# EAGLE design displayadapter (EAGLE 7.2.0)
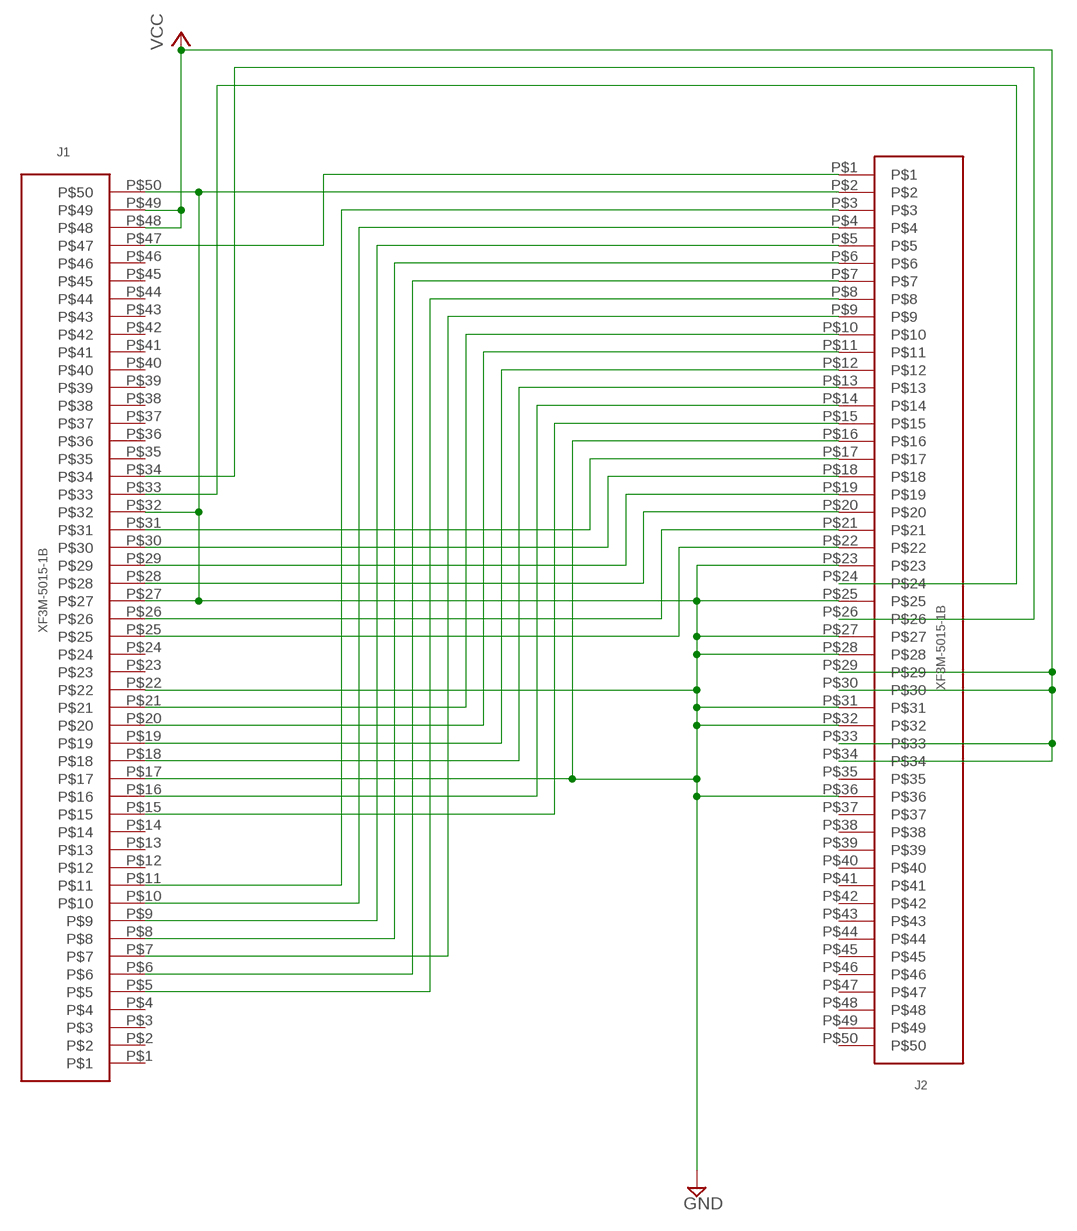
[diagram p0: schematic, sheet 1]

## Parts
J1  XF3M-5015-1B  [XF3M-5015-1B]
J2  XF3M-5015-1B  [XF3M-5015-1B]

## Nets
GND: J1.P$17 J1.P$22 J1.P$27 J1.P$32 J1.P$50 J2.P$2 J2.P$16 J2.P$23 J2.P$25 J2.P$27 J2.P$28 J2.P$31 J2.P$32 J2.P$36
N$11: J1.P$47 J2.P$1
N$31: J1.P$11 J2.P$3
N$32: J1.P$10 J2.P$4
N$36: J1.P$9 J2.P$5
N$38: J1.P$8 J2.P$6
N$39: J1.P$6 J2.P$7
N$40: J1.P$5 J2.P$8
N$41: J1.P$7 J2.P$9
N$42: J1.P$21 J2.P$10
N$43: J1.P$20 J2.P$11
N$44: J1.P$19 J2.P$12
N$45: J1.P$18 J2.P$13
N$47: J1.P$16 J2.P$14
N$48: J1.P$15 J2.P$15
N$50: J1.P$31 J2.P$17
N$51: J1.P$30 J2.P$18
N$52: J1.P$29 J2.P$19
N$53: J1.P$28 J2.P$20
N$54: J1.P$26 J2.P$21
N$55: J1.P$25 J2.P$22
N$57: J1.P$33 J2.P$24
N$58: J1.P$34 J2.P$26
VCC: J1.P$48 J1.P$49 J2.P$29 J2.P$30 J2.P$33 J2.P$34
Unconnected: J1.P$1 J1.P$2 J1.P$3 J1.P$4 J1.P$12 J1.P$13 J1.P$14 J1.P$23 J1.P$24 J1.P$35 J1.P$36 J1.P$37 J1.P$38 J1.P$39 J1.P$40 J1.P$41 J1.P$42 J1.P$43 J1.P$44 J1.P$45 J1.P$46 J2.P$35 J2.P$37 J2.P$38 J2.P$39 J2.P$40 J2.P$41 J2.P$42 J2.P$43 J2.P$44 J2.P$45 J2.P$46 J2.P$47 J2.P$48 J2.P$49 J2.P$50

## Library data of the parts
J1 J2 = mylib:XF3M-5015-1B

## Board
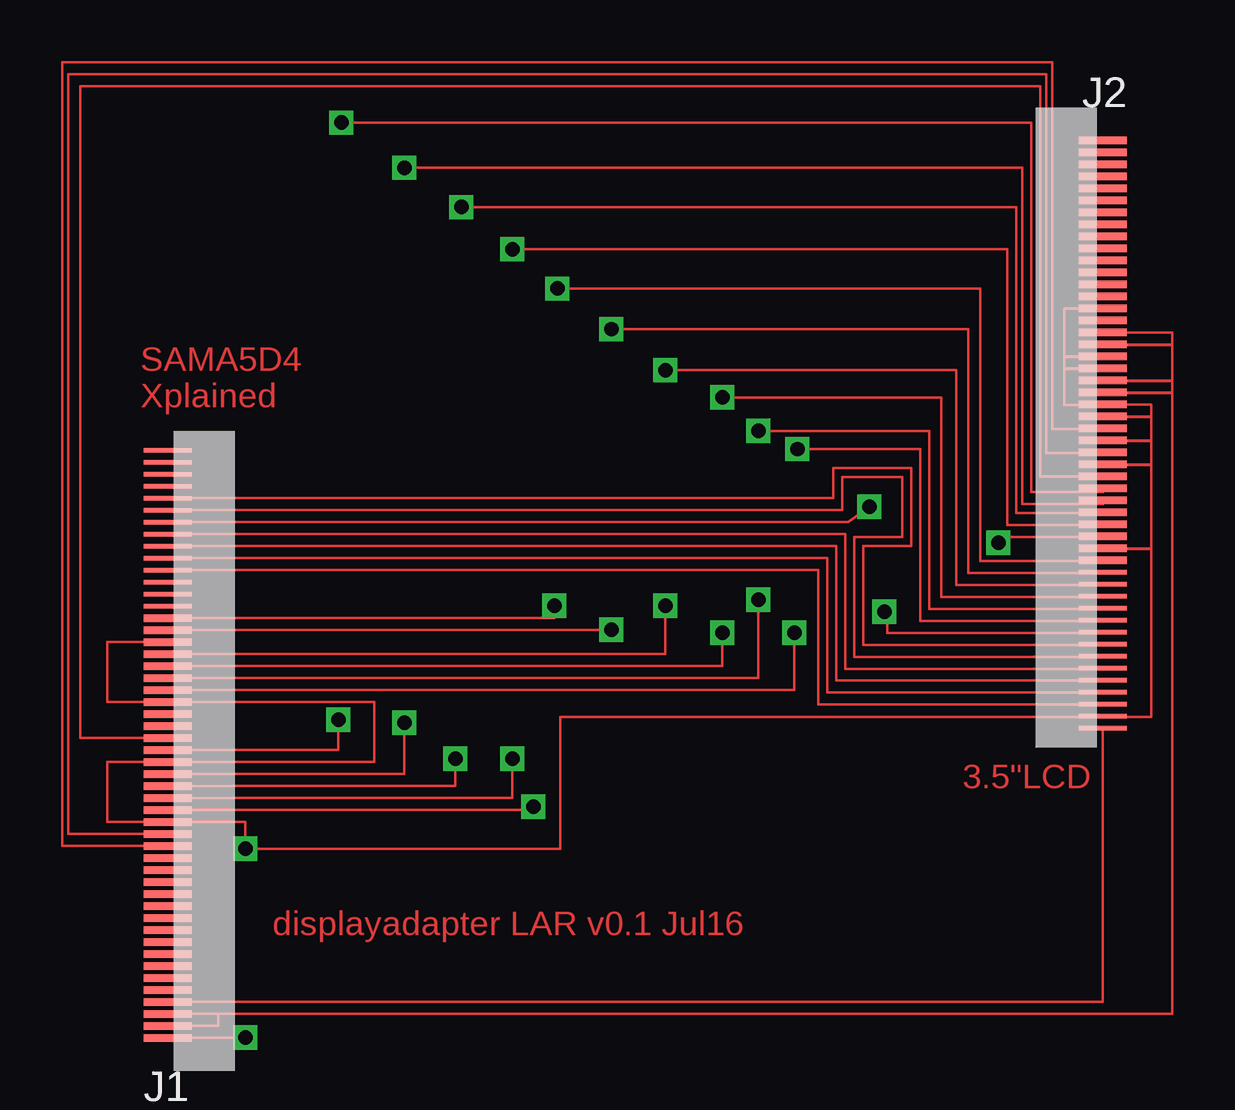
[diagram p1: board, top side]
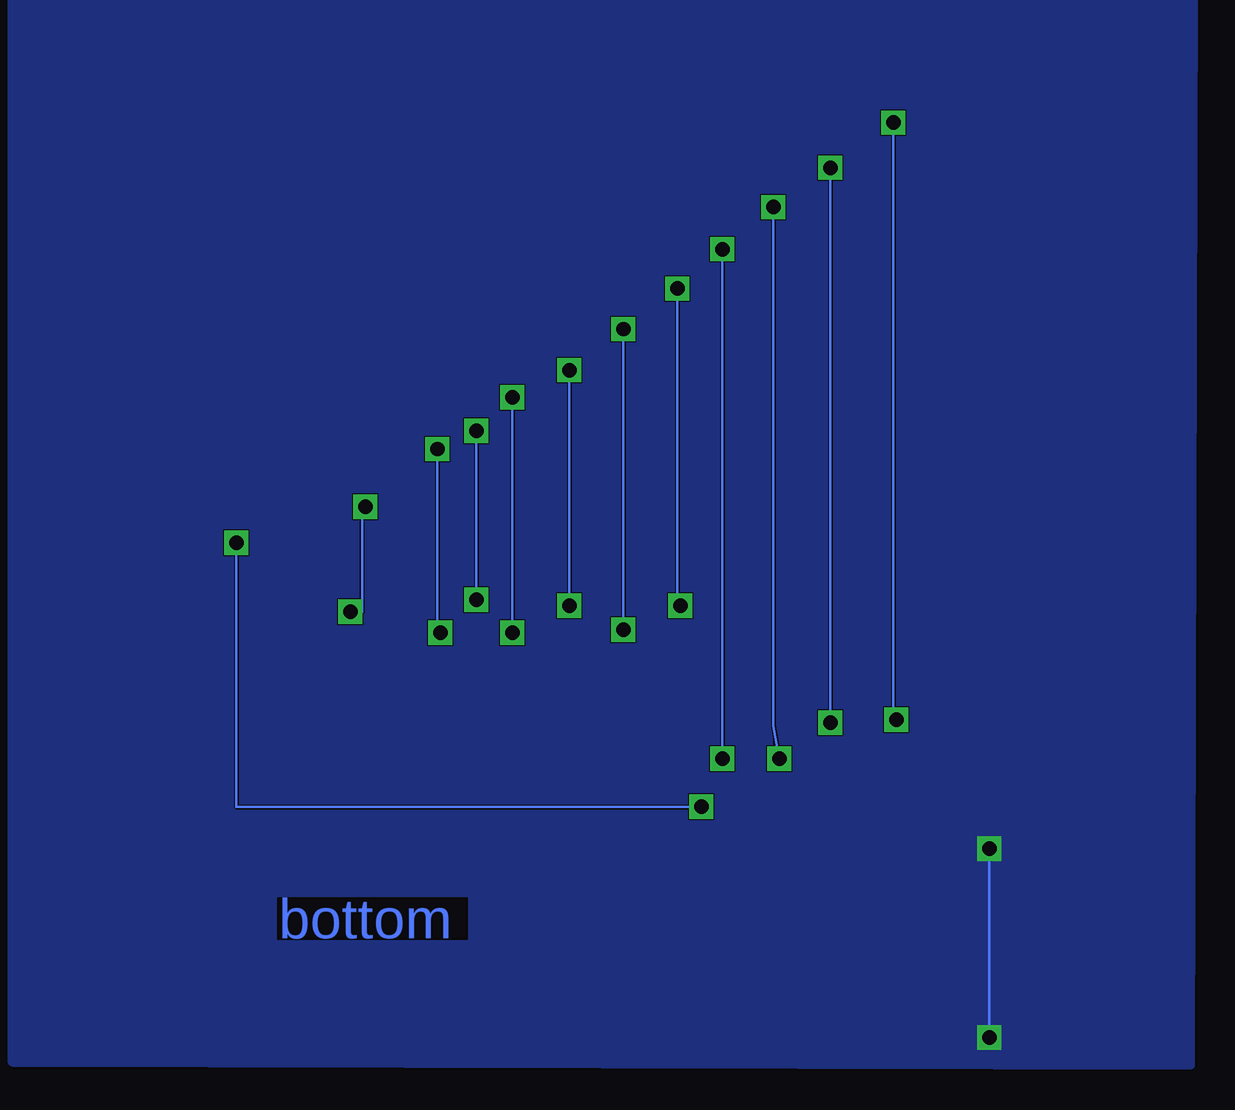
[diagram p2: board, bottom side, seen from below]

No outline drawn. Coordinates in mm, seen from the top.
Copper layers (1*16): Top 0.035mm / dielectric 1.5mm / Bottom 0.035mm
Design rules "default *": minimum track width 0.1mm, minimum drill 24mil, track to track 0.05mm, track to pad 8mil, pad to pad 8mil, via to via 8mil, smd to smd 8mil, copper to edge 40mil, drill to drill 8mil, minimum pad ring 10mil, minimum via ring 8mil, stop-mask expansion 4mil, vias tented up to drill 0mil, thermal gap 10mil

### Footprints (pad centres in the part's own frame; a part is rotated, then mirrored left to right if it is on the bottom)
XF3M-5015-1B = smd 2 x 0.2: P$1 1.02,24.605; P$2 1.02,24.105; P$3 1.02,23.605; P$4 1.02,23.105; P$5 1.02,22.605; P$6 1.02,22.105; P$7 1.02,21.605; P$8 1.02,21.105; P$9 1.02,20.605; P$10 1.02,20.105; P$11 1.02,19.605; P$12 1.02,19.105; P$13 1.02,18.605; P$14 1.02,18.105 | smd 2 x 0.3: P$15 1.02,17.605; P$16 1.02,17.105; P$17 1.02,16.605; P$18 1.02,16.105; P$19 1.02,15.605; P$20 1.02,15.105; P$21 1.02,14.605; P$22 1.02,14.105; P$23 1.02,13.605; P$24 1.02,13.105; P$25 1.02,12.605; P$26 1.02,12.105; P$27 1.02,11.605; P$28 1.02,11.105; P$29 1.02,10.605; P$30 1.02,10.105; P$31 1.02,9.605; P$32 1.02,9.105; P$33 1.02,8.605; P$34 1.02,8.105; P$35 1.02,7.605; P$36 1.02,7.105; P$37 1.02,6.605; P$38 1.02,6.105; P$39 1.02,5.605; P$40 1.02,5.105; P$41 1.02,4.605; P$42 1.02,4.105; P$43 1.02,3.605; P$44 1.02,3.105; P$45 1.02,2.605; P$46 1.02,2.105; P$47 1.02,1.605; P$48 1.02,1.105; P$49 1.02,0.605; P$50 1.02,0.105

### Placement (x,y rotation side)
J1  4.25,0.88 0 top
J2  45.25,38.5 180 top

### Tracks (layer width: path | path; a pad name or v marks a point on that pad's centre or on a via)
GND  (via drill 0.6)
  Top 0.1: J1.P$50 5.27,1 v8.5,1 | 2.75,12.48 2.75,10 5.27,10 J1.P$32 8.5,9.98 v8.5,8.88 21.62,8.88 21.62,14.38 44.23,14.38 | 2.75,12.5 2.75,12.48 | 2.75,12.48 J1.P$27 5.27,12.5 13.88,12.5 13.88,14.98 J1.P$22 5.27,15 2.75,15 2.75,17.48 | 2.75,17.5 2.75,17.48 | 2.75,17.48 J1.P$17 | J2.P$2 44.23,14.38 | 44.23,14.38 46.25,14.38 46.25,21.38 | 46.25,21.38 46.25,21.39 | 46.25,21.39 J2.P$16 44.23,21.38 46.25,21.38 | 46.25,21.39 46.25,24.88 | 46.25,24.88 46.25,24.89 | 46.25,24.89 J2.P$23 44.23,24.88 46.25,24.88 | 46.25,24.89 46.25,25.88 | 46.25,25.88 46.25,25.89 | 46.25,25.89 J2.P$25 44.23,25.88 46.25,25.88 | 46.25,25.89 46.25,26.88 | 46.25,26.88 46.25,26.89 | 46.25,26.89 J2.P$27 44.23,26.88 46.25,26.88 | 46.25,26.89 46.25,27.39 J2.P$28 44.23,27.38 42.62,27.38 42.62,28.88 | 42.62,28.88 42.62,28.89 | 42.62,28.89 J2.P$31 44.23,28.88 42.62,28.88 | 42.62,28.89 42.62,29.38 | 42.62,29.38 42.62,29.39 | 42.62,29.39 J2.P$32 44.23,29.38 42.62,29.38 | 42.62,29.39 42.62,31.39 J2.P$36
  Bottom 0.1: v8.5,1 v8.5,8.88
  pour Bottom: 0,45 49.2,45 49.2,0 0.12,-0.12
N$11
  Top 0.1: J2.P$1 44.23,2.48 J1.P$47
N$31
  Top 0.1: J2.P$3 32.38,14.89 32.38,20.5 5.27,20.5 J1.P$11
N$32
  Top 0.1: J2.P$4 32.75,15.39 32.75,21 5.27,21 J1.P$10
N$36
  Top 0.1: J2.P$5 33.12,15.89 33.12,21.5 5.27,21.5 J1.P$9
N$38
  Top 0.1: J1.P$8 33.5,21.98 33.5,16.38 44.23,16.38 J2.P$6
N$39
  Top 0.1: J2.P$7 44.23,16.88 33.88,16.88 33.88,21.88 35.88,21.88 35.88,24.38 33.38,24.38 33.38,22.98 J1.P$6
N$40
  Top 0.1: J2.P$8 44.23,17.38 34.25,17.38 34.25,21.5 36.25,21.5 36.25,24.75 33,24.75 33,23.48 J1.P$5
N$41  (via drill 0.6)
  Top 0.1: J2.P$9 44.23,17.88 35.25,17.88 35.25,18.75 v35.12,18.75 | v34.5,23.12 33.62,22.48 J1.P$7
  Bottom 0.1: v35.12,18.75 34.62,18.75 34.62,23.12 v34.5,23.12
N$42  (via drill 0.6)
  Top 0.1: J2.P$10 44.23,18.38 36.62,18.38 36.62,25.53 v31.5,25.53 | v31.38,17.88 31.38,15.48 J1.P$21
  Bottom 0.1: v31.5,25.53 31.5,17.88 v31.38,17.88
N$43  (via drill 0.6)
  Top 0.1: J2.P$11 44.23,18.88 37,18.88 37,26.29 v29.88,26.29 | v29.88,19.25 29.88,15.98 J1.P$20
  Bottom 0.1: v29.88,26.29 v29.88,19.25
N$44  (via drill 0.6)
  Top 0.1: J2.P$12 44.23,19.38 37.5,19.38 37.5,27.68 v28.38,27.68 | v28.38,17.88 28.38,16.48 J1.P$19
  Bottom 0.1: v28.38,27.68 v28.38,17.88
N$45  (via drill 0.6)
  Top 0.1: J2.P$13 44.23,19.88 38.12,19.88 38.12,28.82 v26,28.82 | v26,19 26,16.98 J1.P$18
  Bottom 0.1: v26,28.82 v26,19
N$47  (via drill 0.6)
  Top 0.1: J2.P$14 44.23,20.38 38.62,20.38 38.62,30.53 v23.75,30.53 | v23.75,18 23.75,17.98 J1.P$16
  Bottom 0.1: v23.75,30.53 v23.75,18
N$48  (via drill 0.6)
  Top 0.1: J2.P$15 44.23,20.88 39.12,20.88 39.12,32.23 v21.5,32.23 | v21.38,19 21.38,18.48 J1.P$15
  Bottom 0.1: v21.5,32.23 21.5,19.38 v21.38,19
N$50  (via drill 0.6)
  Top 0.1: J2.P$17 44.23,21.88 39.88,21.88 v39.88,21.62 | v20.5,10.62 20.5,10.48 J1.P$31
  Bottom 0.1: v39.88,21.62 39.88,10.62 v20.5,10.62
N$51  (via drill 0.6)
  Top 0.1: J2.P$18 44.23,22.38 40.25,22.38 40.25,33.86 v19.62,33.86 | v19.62,12.62 19.62,10.98 J1.P$30
  Bottom 0.1: v19.62,33.86 v19.62,12.62
N$52  (via drill 0.6)
  Top 0.1: J2.P$19 44.23,22.88 40.62,22.88 40.62,35.62 v17.5,35.62 | v17.25,12.62 17.25,11.48 J1.P$29
  Bottom 0.1: v17.5,35.62 17.5,14 v17.25,12.62
N$53  (via drill 0.6)
  Top 0.1: J2.P$20 44.23,23.25 40.88,23.25 40.88,37.26 v15.12,37.26 | v15.12,14.12 15.12,11.98 J1.P$28
  Bottom 0.1: v15.12,37.26 v15.12,14.12
N$54  (via drill 0.6)
  Top 0.1: J2.P$21 44.23,23.75 41.25,23.75 41.25,39.14 v12.5,39.14 | v12.38,14.25 12.38,12.98 J1.P$26
  Bottom 0.1: v12.5,39.14 12.5,14.25 v12.38,14.25
N$55
  Top 0.1: J2.P$22 41.62,24.39 41.62,40.65 1.62,40.65 1.62,13.5 5.27,13.5 J1.P$25
N$57
  Top 0.1: J1.P$33 1.12,9.48 1.12,41.15 41.88,41.15 41.88,25.38 44.23,25.38 J2.P$24
N$58
  Top 0.1: J1.P$34 0.88,8.98 0.88,41.65 42.12,41.65 42.12,26.38 44.23,26.38 J2.P$26
VCC
  Top 0.1: 7.38,2 5.27,2 J1.P$48 | 7.38,2 7.38,1.48 J1.P$49 | 7.38,2 47.12,2 47.12,27.88 | 47.12,27.88 47.12,27.89 | 47.12,27.89 J2.P$29 44.23,27.88 47.12,27.88 | 47.12,27.89 47.12,28.38 | 47.12,28.38 47.12,28.39 | 47.12,28.39 J2.P$30 44.23,28.38 47.12,28.38 | 47.12,28.39 47.12,29.88 | 47.12,29.88 47.12,29.89 | 47.12,29.89 J2.P$33 44.23,29.88 47.12,29.88 | 47.12,29.89 47.12,30.39 J2.P$34

### Text on the board
Top: SAMA5D4 / Xplained | 3.5"LCD | displayadapter LAR v0.1 Jul16
Bottom: bottom